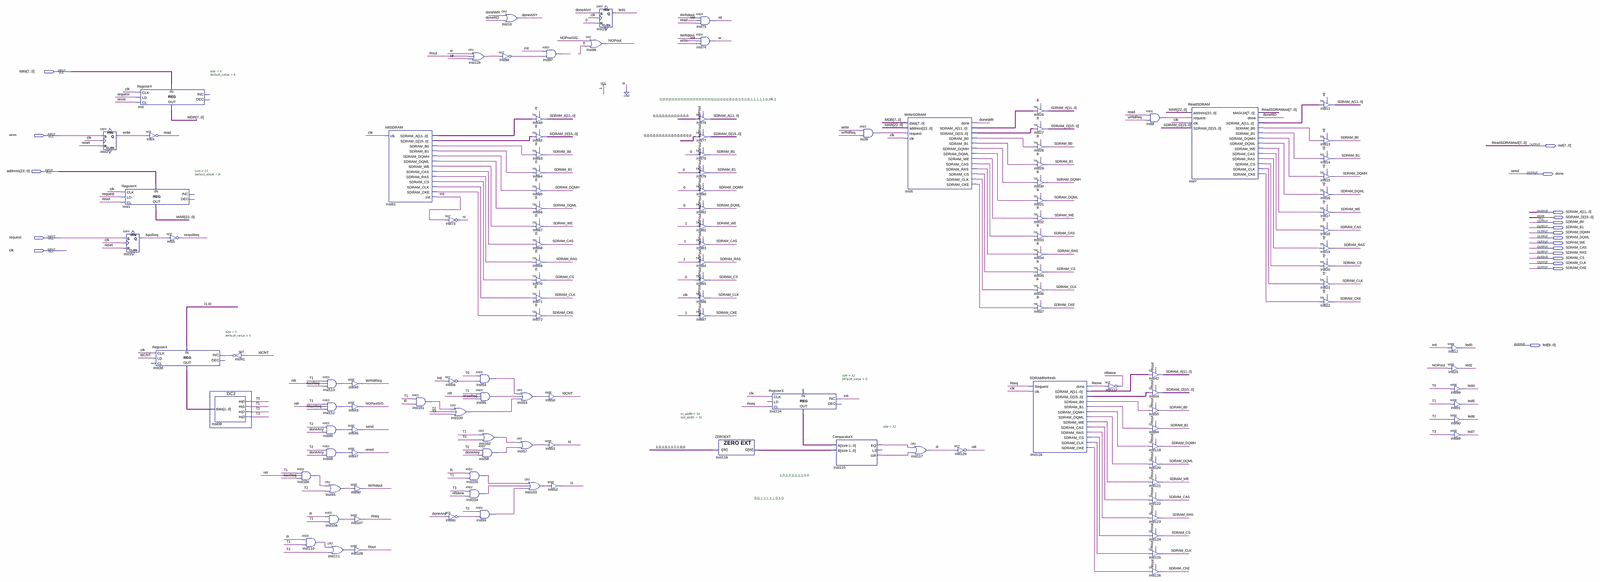
[diagram p0: schematic sheet, whole]
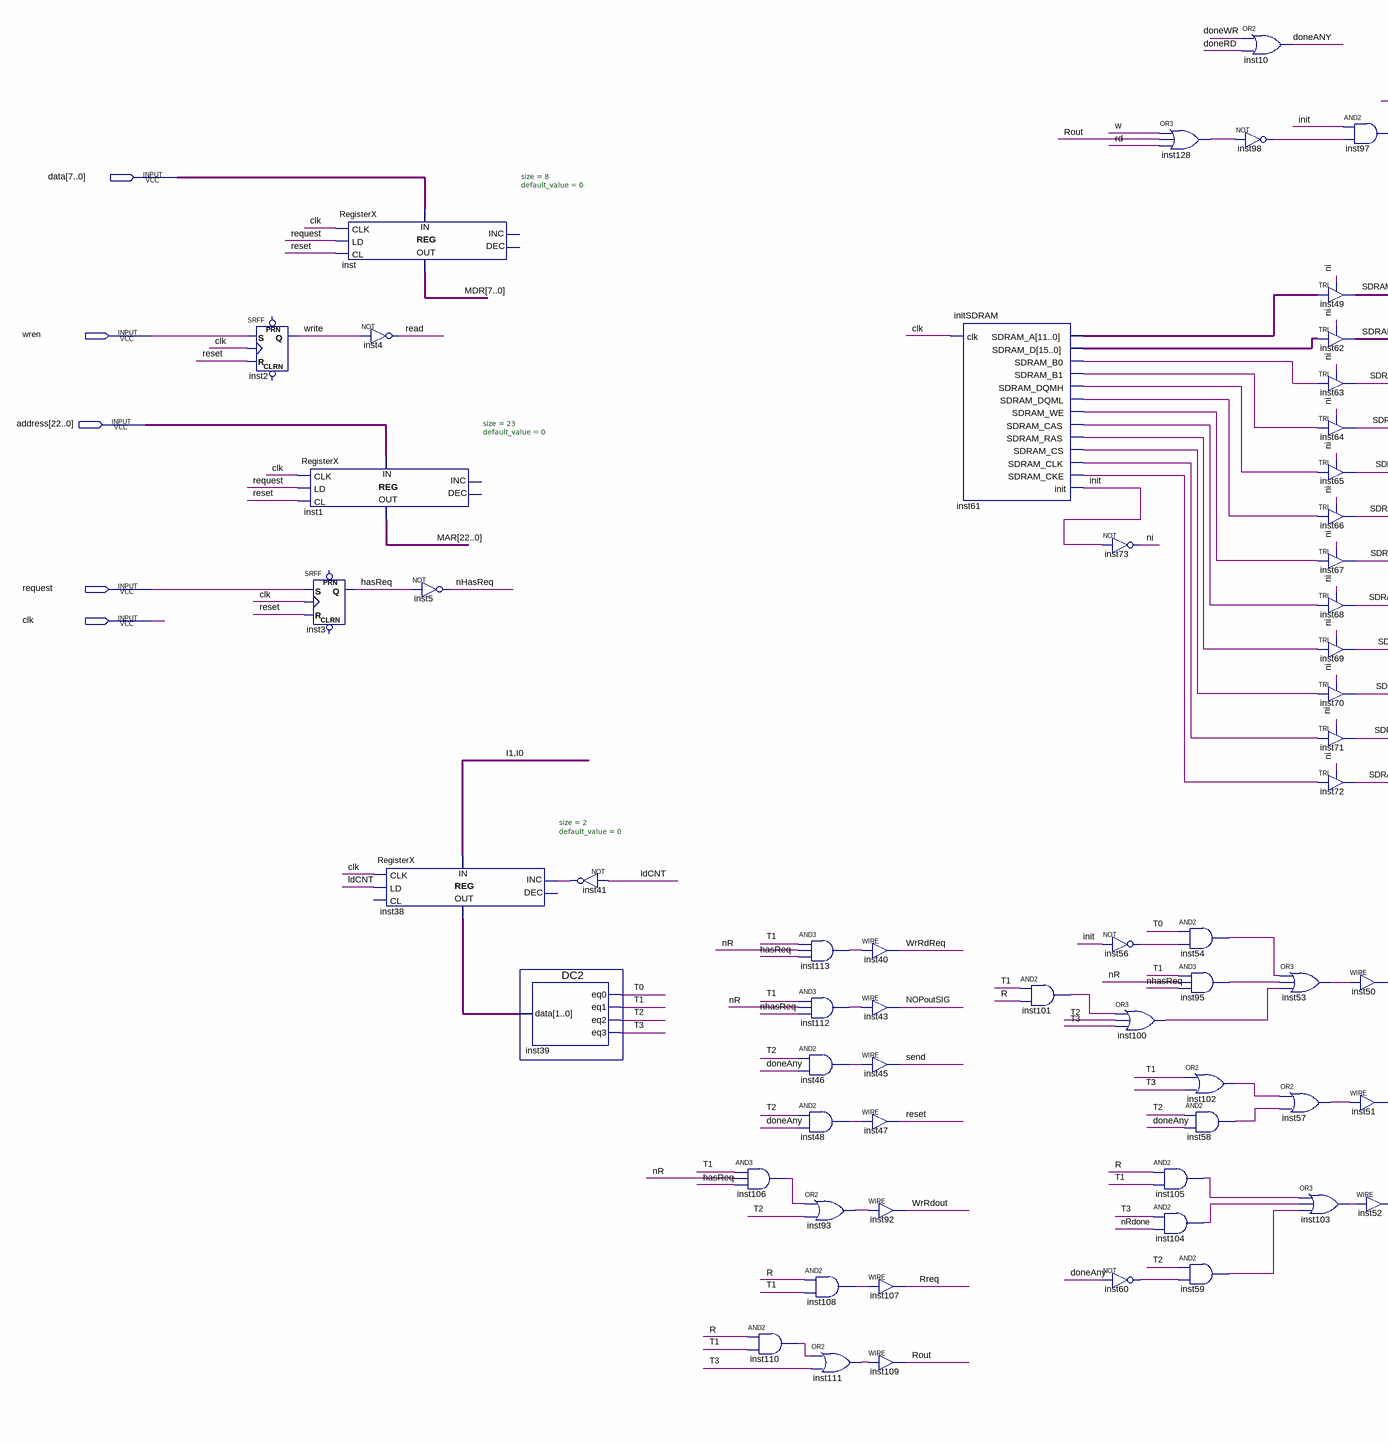
[diagram p1: schematic sheet, left part]
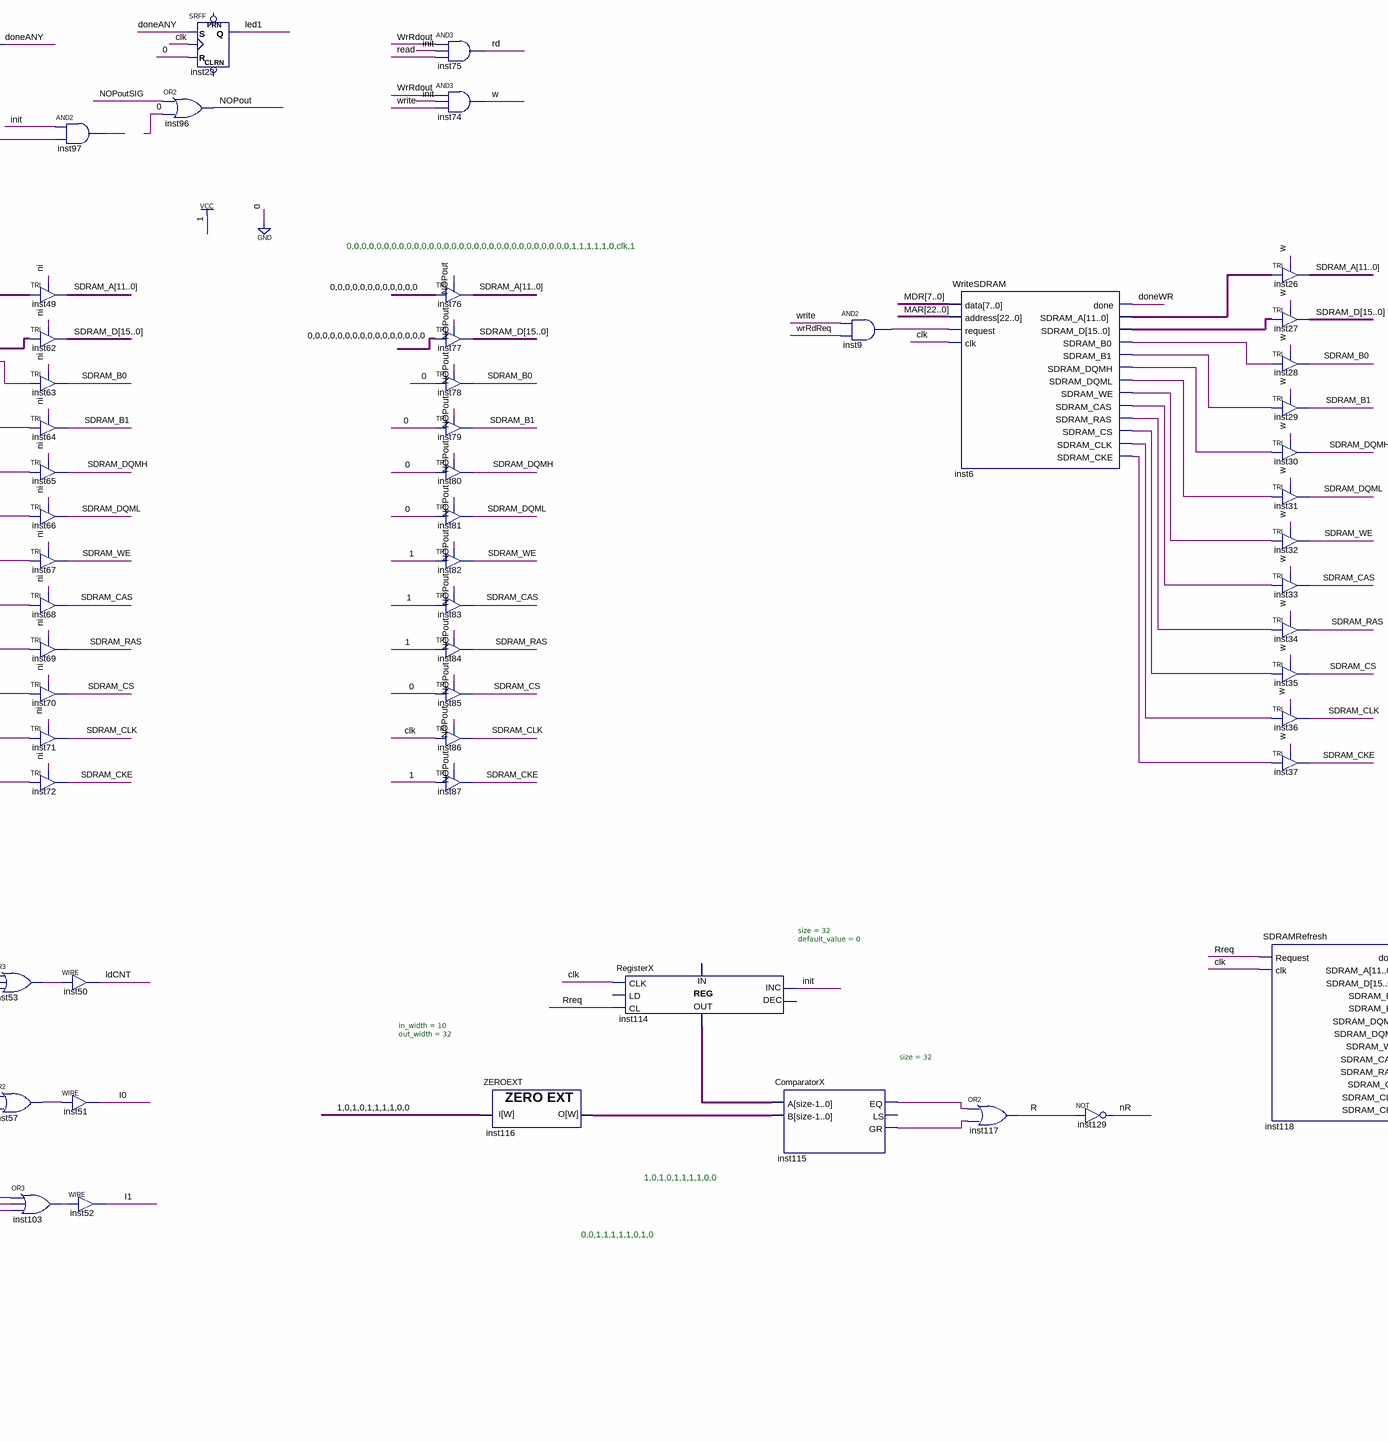
[diagram p2: schematic sheet, centre part]
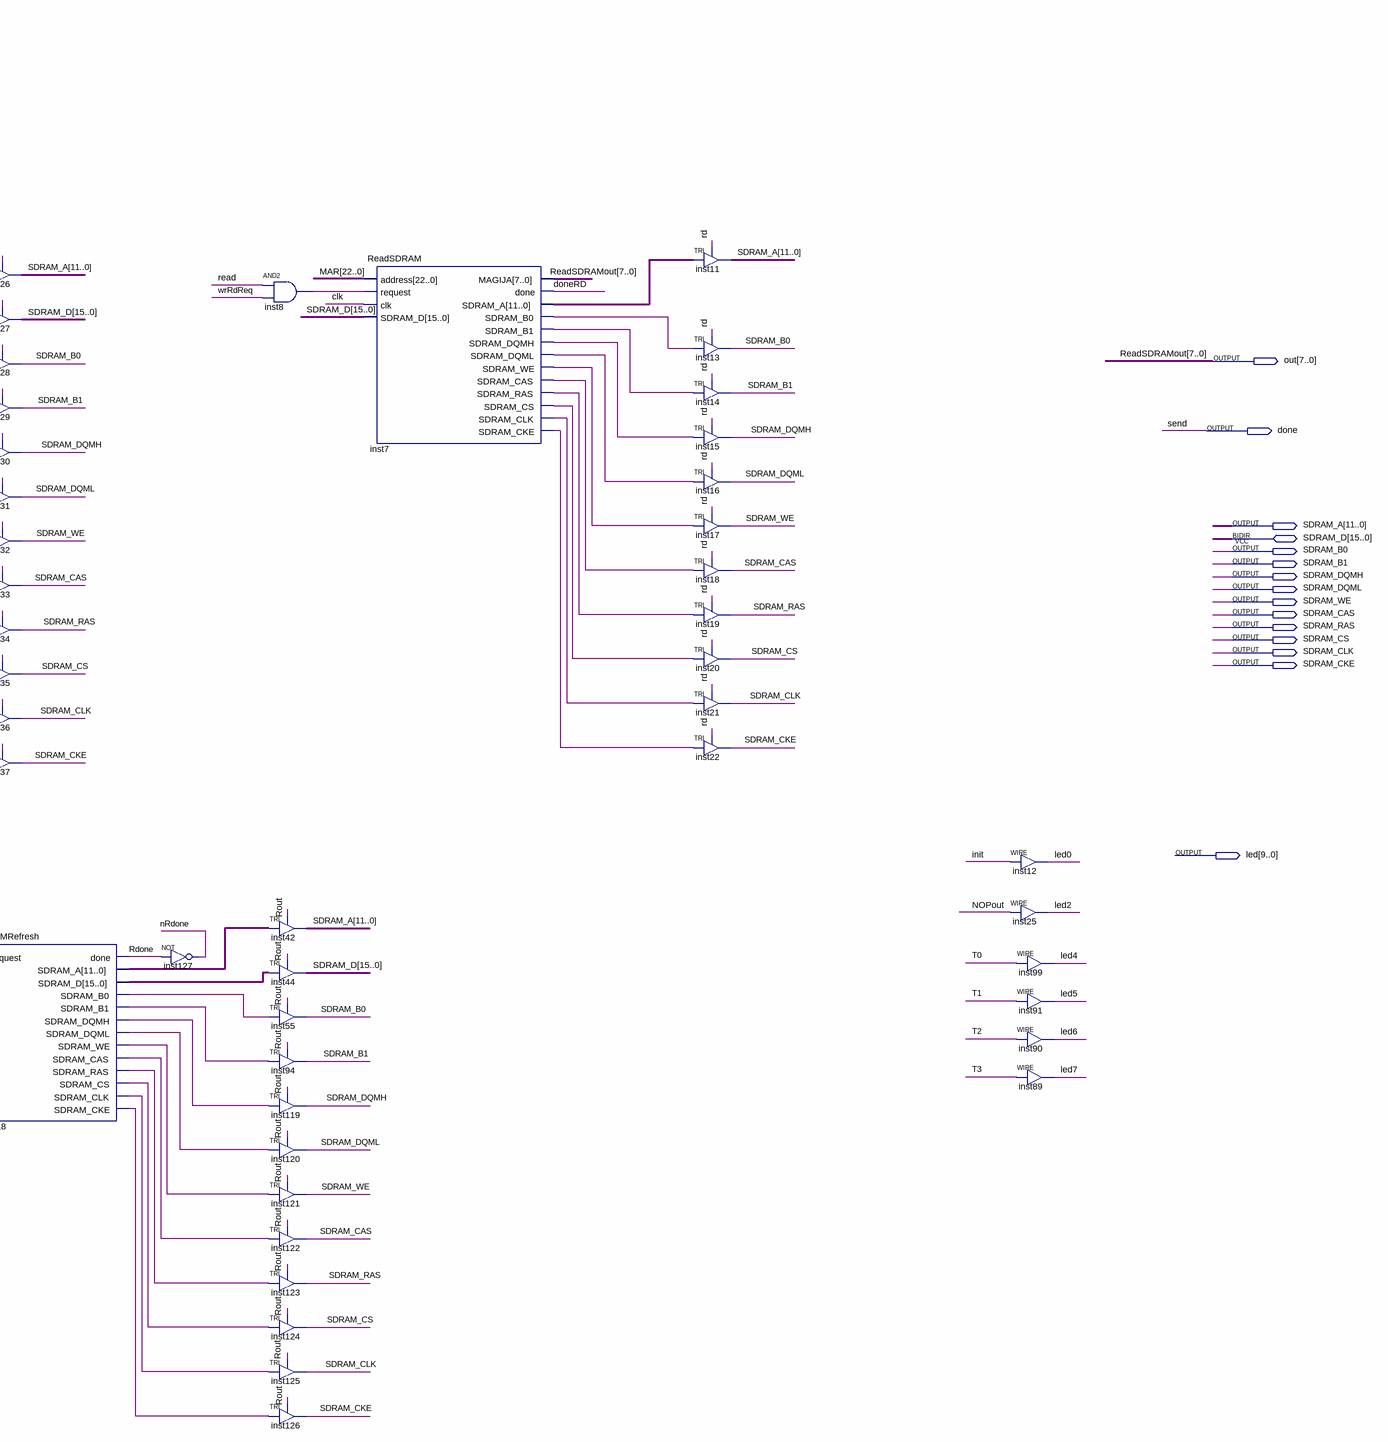
[diagram p3: schematic sheet, right part]
// Quartus schematic SDRAM.bdf as structural Verilog: 128 symbols, 20 pins
module SDRAM (
  input  [7:0] data,
  input  wren,
  input  [22:0] address,
  input  request,
  input  clk,
  inout  [15:0] SDRAM_D,
  output [7:0] out,
  output done,
  output [11:0] SDRAM_A,
  output SDRAM_B0,
  output SDRAM_B1,
  output SDRAM_DQMH,
  output SDRAM_DQML,
  output SDRAM_WE,
  output SDRAM_CAS,
  output SDRAM_RAS,
  output SDRAM_CS,
  output SDRAM_CLK,
  output SDRAM_CKE,
  output [9:0] led
);

  wire doneANY, doneRD, doneWR, hasReq, I0, I1, init, inst6_sdram_b0, inst6_sdram_b1, inst6_sdram_cas,
       inst6_sdram_cke, inst6_sdram_clk, inst6_sdram_cs, inst6_sdram_dqmh, inst6_sdram_dqml, inst6_sdram_ras,
       inst6_sdram_we, inst7_sdram_b0, inst7_sdram_b1, inst7_sdram_cas, inst7_sdram_cke, inst7_sdram_clk,
       inst7_sdram_cs, inst7_sdram_dqmh, inst7_sdram_dqml, inst7_sdram_ras, inst7_sdram_we, inst8_out,
       inst9_out, inst41_out, inst46_out, inst48_out, inst53_out, inst54_out, inst56_out, inst57_out,
       inst58_out, inst59_out, inst60_out, inst61_sdram_b0, inst61_sdram_b1, inst61_sdram_cas,
       inst61_sdram_cke, inst61_sdram_clk, inst61_sdram_cs, inst61_sdram_dqmh, inst61_sdram_dqml,
       inst61_sdram_ras, inst61_sdram_we, inst93_out, inst95_out, inst97_out, inst98_out, inst100_out,
       inst101_out, inst102_out, inst103_out, inst104_out, inst105_out, inst106_out, inst108_out,
       inst110_out, inst111_out, inst112_out, inst113_out, inst115_eq, inst115_gr, inst118_sdram_b0,
       inst118_sdram_b1, inst118_sdram_cas, inst118_sdram_cke, inst118_sdram_clk, inst118_sdram_cs,
       inst118_sdram_dqmh, inst118_sdram_dqml, inst118_sdram_ras, inst118_sdram_we, inst128_out, ldCNT,
       nHasReq, ni, NOPout, NOPoutSIG, nR, nRdone, R, rd, Rdone, read, reset, Rout, Rreq, T0, T1, T2, T3, w,
       write, WrRdout, WrRdReq;
  wire [1:0] inst38_data_out;
  wire [7:0] MDR;
  wire [11:0] inst6_sdram_a, inst7_sdram_a, inst61_sdram_a, inst118_sdram_a;
  wire [15:0] inst6_sdram_d, inst61_sdram_d, inst118_sdram_d;
  wire [22:0] MAR;
  wire [31:0] inst114_data_out, inst116_o;

  SRFF inst2 (.S(wren), .R(reset), .CLK(clk), .Q(write));  // open: PRN, CLRN
  RegisterX #(.size(8), .default_value(0)) inst (
    .CLK(clk), .LD(request), .CL(reset), .DATA_IN(data), .DATA_OUT(MDR));  // open: INC, DEC
  RegisterX #(.size(23), .default_value(0)) inst1 (
    .CLK(clk), .LD(request), .CL(reset), .DATA_IN(address), .DATA_OUT(MAR));  // open: INC, DEC
  SRFF inst3 (.S(request), .R(reset), .CLK(clk), .Q(hasReq));  // open: PRN, CLRN
  not inst4 (read, write);
  RegisterX #(.size(2), .default_value(0)) inst38 (
    .CLK(clk), .LD(ldCNT), .INC(inst41_out), .DATA_IN({I1, I0}), .DATA_OUT(inst38_data_out));  // open: CL, DEC
  not inst5 (nHasReq, hasReq);
  DC2 inst39 (.data(inst38_data_out), .eq0(T0), .eq1(T1), .eq2(T2), .eq3(T3));
  not inst41 (inst41_out, ldCNT);
  and inst106 (inst106_out, T1, nR, hasReq);
  and inst110 (inst110_out, R, T1);
  and inst113 (inst113_out, T1, nR, hasReq);
  and inst112 (inst112_out, T1, nR, nHasReq);
  and inst46 (inst46_out, T2, doneANY);
  and inst48 (inst48_out, T2, doneANY);
  or inst93 (inst93_out, inst106_out, T2);
  and inst108 (inst108_out, R, T1);
  or inst111 (inst111_out, inst110_out, T3);
  assign WrRdReq = inst113_out;  // WIRE inst40
  assign NOPoutSIG = inst112_out;  // WIRE inst43
  assign done = inst46_out;  // WIRE inst45
  assign reset = inst48_out;  // WIRE inst47
  assign WrRdout = inst93_out;  // WIRE inst92
  assign Rreq = inst108_out;  // WIRE inst107
  assign Rout = inst111_out;  // WIRE inst109
  initSDRAM inst61 (
    .clk(clk), .SDRAM_A(inst61_sdram_a), .SDRAM_B0(inst61_sdram_b0), .SDRAM_B1(inst61_sdram_b1),
    .SDRAM_DQMH(inst61_sdram_dqmh), .SDRAM_DQML(inst61_sdram_dqml), .SDRAM_WE(inst61_sdram_we),
    .SDRAM_CAS(inst61_sdram_cas), .SDRAM_RAS(inst61_sdram_ras), .SDRAM_CS(inst61_sdram_cs),
    .SDRAM_CLK(inst61_sdram_clk), .SDRAM_CKE(inst61_sdram_cke), .init(init), .SDRAM_D(inst61_sdram_d));
  and inst101 (inst101_out, T1, R);
  not inst73 (ni, init);
  not inst56 (inst56_out, init);
  or inst100 (inst100_out, inst101_out, T2, T3);
  not inst60 (inst60_out, doneANY);
  or inst128 (inst128_out, w, Rout, rd);
  and inst54 (inst54_out, T0, inst56_out);
  and inst95 (inst95_out, T1, nR, nHasReq);
  or inst102 (inst102_out, T1, T3);
  and inst58 (inst58_out, T2, doneANY);
  and inst105 (inst105_out, R, T1);
  and inst104 (inst104_out, T3, nRdone);
  and inst59 (inst59_out, T2, inst60_out);
  or inst10 (doneANY, doneWR, doneRD);
  not inst98 (inst98_out, inst128_out);
  or inst53 (inst53_out, inst54_out, inst95_out, inst100_out);
  or inst57 (inst57_out, inst102_out, inst58_out);
  or inst103 (inst103_out, inst105_out, inst104_out, inst59_out);
  and inst97 (inst97_out, init, inst98_out);
  TRI inst49[11:0] (.IN(inst61_sdram_a), .OE(ni), .OUT(SDRAM_A));
  TRI inst62[15:0] (.IN(inst61_sdram_d), .OE(ni), .OUT(SDRAM_D));
  TRI inst63 (.IN(inst61_sdram_b0), .OE(ni), .OUT(SDRAM_B0));
  TRI inst64 (.IN(inst61_sdram_b1), .OE(ni), .OUT(SDRAM_B1));
  TRI inst65 (.IN(inst61_sdram_dqmh), .OE(ni), .OUT(SDRAM_DQMH));
  TRI inst66 (.IN(inst61_sdram_dqml), .OE(ni), .OUT(SDRAM_DQML));
  TRI inst67 (.IN(inst61_sdram_we), .OE(ni), .OUT(SDRAM_WE));
  TRI inst68 (.IN(inst61_sdram_cas), .OE(ni), .OUT(SDRAM_CAS));
  TRI inst69 (.IN(inst61_sdram_ras), .OE(ni), .OUT(SDRAM_RAS));
  TRI inst70 (.IN(inst61_sdram_cs), .OE(ni), .OUT(SDRAM_CS));
  TRI inst71 (.IN(inst61_sdram_clk), .OE(ni), .OUT(SDRAM_CLK));
  TRI inst72 (.IN(inst61_sdram_cke), .OE(ni), .OUT(SDRAM_CKE));
  assign ldCNT = inst53_out;  // WIRE inst50
  assign I0 = inst57_out;  // WIRE inst51
  assign I1 = inst103_out;  // WIRE inst52
  or inst96 (NOPout, NOPoutSIG, 1'b0);
  SRFF inst23 (.S(doneANY), .R(1'b0), .CLK(clk), .Q(led[1]));  // open: PRN, CLRN
  and inst75 (rd, WrRdout, init, read);
  and inst74 (w, WrRdout, init, write);
  TRI inst76[11:0] (.IN({12{1'b0}}), .OE(NOPout), .OUT(SDRAM_A));
  TRI inst77[15:0] (.IN({16{1'b0}}), .OE(NOPout), .OUT(SDRAM_D));
  TRI inst78 (.IN(1'b0), .OE(NOPout), .OUT(SDRAM_B0));
  TRI inst79 (.IN(1'b0), .OE(NOPout), .OUT(SDRAM_B1));
  TRI inst80 (.IN(1'b0), .OE(NOPout), .OUT(SDRAM_DQMH));
  TRI inst81 (.IN(1'b0), .OE(NOPout), .OUT(SDRAM_DQML));
  TRI inst82 (.IN(1'b1), .OE(NOPout), .OUT(SDRAM_WE));
  TRI inst83 (.IN(1'b1), .OE(NOPout), .OUT(SDRAM_CAS));
  TRI inst84 (.IN(1'b1), .OE(NOPout), .OUT(SDRAM_RAS));
  TRI inst85 (.IN(1'b0), .OE(NOPout), .OUT(SDRAM_CS));
  TRI inst86 (.IN(clk), .OE(NOPout), .OUT(SDRAM_CLK));
  TRI inst87 (.IN(1'b1), .OE(NOPout), .OUT(SDRAM_CKE));
  ZEROEXT #(.in_width(10), .out_width(32)) inst116 (.I(10'b1010111100), .O(inst116_o));
  RegisterX #(.size(32), .default_value(0)) inst114 (
    .CLK(clk), .CL(Rreq), .INC(init), .DATA_OUT(inst114_data_out));  // open: LD, DEC, DATA_IN
  ComparatorX #(.size(32)) inst115 (.A(inst114_data_out), .B(inst116_o), .EQ(inst115_eq), .GR(inst115_gr));  // open: LS
  and inst9 (inst9_out, write, WrRdReq);
  WriteSDRAM inst6 (
    .data(MDR), .address(MAR), .request(inst9_out), .clk(clk), .done(doneWR), .SDRAM_A(inst6_sdram_a),
    .SDRAM_B0(inst6_sdram_b0), .SDRAM_B1(inst6_sdram_b1), .SDRAM_DQMH(inst6_sdram_dqmh),
    .SDRAM_DQML(inst6_sdram_dqml), .SDRAM_WE(inst6_sdram_we), .SDRAM_CAS(inst6_sdram_cas),
    .SDRAM_RAS(inst6_sdram_ras), .SDRAM_CS(inst6_sdram_cs), .SDRAM_CLK(inst6_sdram_clk),
    .SDRAM_CKE(inst6_sdram_cke), .SDRAM_D(inst6_sdram_d));
  or inst117 (R, inst115_eq, inst115_gr);
  not inst129 (nR, R);
  TRI inst26[11:0] (.IN(inst6_sdram_a), .OE(w), .OUT(SDRAM_A));
  TRI inst27[15:0] (.IN(inst6_sdram_d), .OE(w), .OUT(SDRAM_D));
  TRI inst28 (.IN(inst6_sdram_b0), .OE(w), .OUT(SDRAM_B0));
  TRI inst29 (.IN(inst6_sdram_b1), .OE(w), .OUT(SDRAM_B1));
  TRI inst30 (.IN(inst6_sdram_dqmh), .OE(w), .OUT(SDRAM_DQMH));
  TRI inst31 (.IN(inst6_sdram_dqml), .OE(w), .OUT(SDRAM_DQML));
  TRI inst32 (.IN(inst6_sdram_we), .OE(w), .OUT(SDRAM_WE));
  TRI inst33 (.IN(inst6_sdram_cas), .OE(w), .OUT(SDRAM_CAS));
  TRI inst34 (.IN(inst6_sdram_ras), .OE(w), .OUT(SDRAM_RAS));
  TRI inst35 (.IN(inst6_sdram_cs), .OE(w), .OUT(SDRAM_CS));
  TRI inst36 (.IN(inst6_sdram_clk), .OE(w), .OUT(SDRAM_CLK));
  TRI inst37 (.IN(inst6_sdram_cke), .OE(w), .OUT(SDRAM_CKE));
  SDRAMRefresh inst118 (
    .Request(Rreq), .clk(clk), .done(Rdone), .SDRAM_A(inst118_sdram_a), .SDRAM_B0(inst118_sdram_b0),
    .SDRAM_B1(inst118_sdram_b1), .SDRAM_DQMH(inst118_sdram_dqmh), .SDRAM_DQML(inst118_sdram_dqml),
    .SDRAM_WE(inst118_sdram_we), .SDRAM_CAS(inst118_sdram_cas), .SDRAM_RAS(inst118_sdram_ras),
    .SDRAM_CS(inst118_sdram_cs), .SDRAM_CLK(inst118_sdram_clk), .SDRAM_CKE(inst118_sdram_cke),
    .SDRAM_D(inst118_sdram_d));
  not inst127 (nRdone, Rdone);
  and inst8 (inst8_out, read, WrRdReq);
  TRI inst42[11:0] (.IN(inst118_sdram_a), .OE(Rout), .OUT(SDRAM_A));
  TRI inst44[15:0] (.IN(inst118_sdram_d), .OE(Rout), .OUT(SDRAM_D));
  TRI inst55 (.IN(inst118_sdram_b0), .OE(Rout), .OUT(SDRAM_B0));
  TRI inst94 (.IN(inst118_sdram_b1), .OE(Rout), .OUT(SDRAM_B1));
  TRI inst119 (.IN(inst118_sdram_dqmh), .OE(Rout), .OUT(SDRAM_DQMH));
  TRI inst120 (.IN(inst118_sdram_dqml), .OE(Rout), .OUT(SDRAM_DQML));
  TRI inst121 (.IN(inst118_sdram_we), .OE(Rout), .OUT(SDRAM_WE));
  TRI inst122 (.IN(inst118_sdram_cas), .OE(Rout), .OUT(SDRAM_CAS));
  TRI inst123 (.IN(inst118_sdram_ras), .OE(Rout), .OUT(SDRAM_RAS));
  TRI inst124 (.IN(inst118_sdram_cs), .OE(Rout), .OUT(SDRAM_CS));
  TRI inst125 (.IN(inst118_sdram_clk), .OE(Rout), .OUT(SDRAM_CLK));
  TRI inst126 (.IN(inst118_sdram_cke), .OE(Rout), .OUT(SDRAM_CKE));
  ReadSDRAM inst7 (
    .address(MAR), .request(inst8_out), .clk(clk), .SDRAM_D(SDRAM_D), .MAGIJA(out), .done(doneRD),
    .SDRAM_A(inst7_sdram_a), .SDRAM_B0(inst7_sdram_b0), .SDRAM_B1(inst7_sdram_b1),
    .SDRAM_DQMH(inst7_sdram_dqmh), .SDRAM_DQML(inst7_sdram_dqml), .SDRAM_WE(inst7_sdram_we),
    .SDRAM_CAS(inst7_sdram_cas), .SDRAM_RAS(inst7_sdram_ras), .SDRAM_CS(inst7_sdram_cs),
    .SDRAM_CLK(inst7_sdram_clk), .SDRAM_CKE(inst7_sdram_cke));
  TRI inst11[11:0] (.IN(inst7_sdram_a), .OE(rd), .OUT(SDRAM_A));
  TRI inst13 (.IN(inst7_sdram_b0), .OE(rd), .OUT(SDRAM_B0));
  TRI inst14 (.IN(inst7_sdram_b1), .OE(rd), .OUT(SDRAM_B1));
  TRI inst15 (.IN(inst7_sdram_dqmh), .OE(rd), .OUT(SDRAM_DQMH));
  TRI inst16 (.IN(inst7_sdram_dqml), .OE(rd), .OUT(SDRAM_DQML));
  TRI inst17 (.IN(inst7_sdram_we), .OE(rd), .OUT(SDRAM_WE));
  TRI inst18 (.IN(inst7_sdram_cas), .OE(rd), .OUT(SDRAM_CAS));
  TRI inst19 (.IN(inst7_sdram_ras), .OE(rd), .OUT(SDRAM_RAS));
  TRI inst20 (.IN(inst7_sdram_cs), .OE(rd), .OUT(SDRAM_CS));
  TRI inst21 (.IN(inst7_sdram_clk), .OE(rd), .OUT(SDRAM_CLK));
  TRI inst22 (.IN(inst7_sdram_cke), .OE(rd), .OUT(SDRAM_CKE));
  assign led[0] = init;  // WIRE inst12
  assign led[2] = NOPout;  // WIRE inst25
  assign led[4] = T0;  // WIRE inst99
  assign led[5] = T1;  // WIRE inst91
  assign led[6] = T2;  // WIRE inst90
  assign led[7] = T3;  // WIRE inst89

  // Other names for the same wires on the sheet: ReadSDRAMout[7:0] = out; send = done

  // Notes on the sheet:
  //   0,0,0,0,0,0,0,0,0,0,0,0,0,0,0,0,0,0,0,0,0,0,0,0,0,0,0,0,0,0,1,1,1,1,1,0,clk,1
  //   1,0,1,0,1,1,1,1,0,0
  //   0,0,1,1,1,1,1,0,1,0
endmodule
